# EAGLE schematic Alimentation (EAGLE 9.5.2)
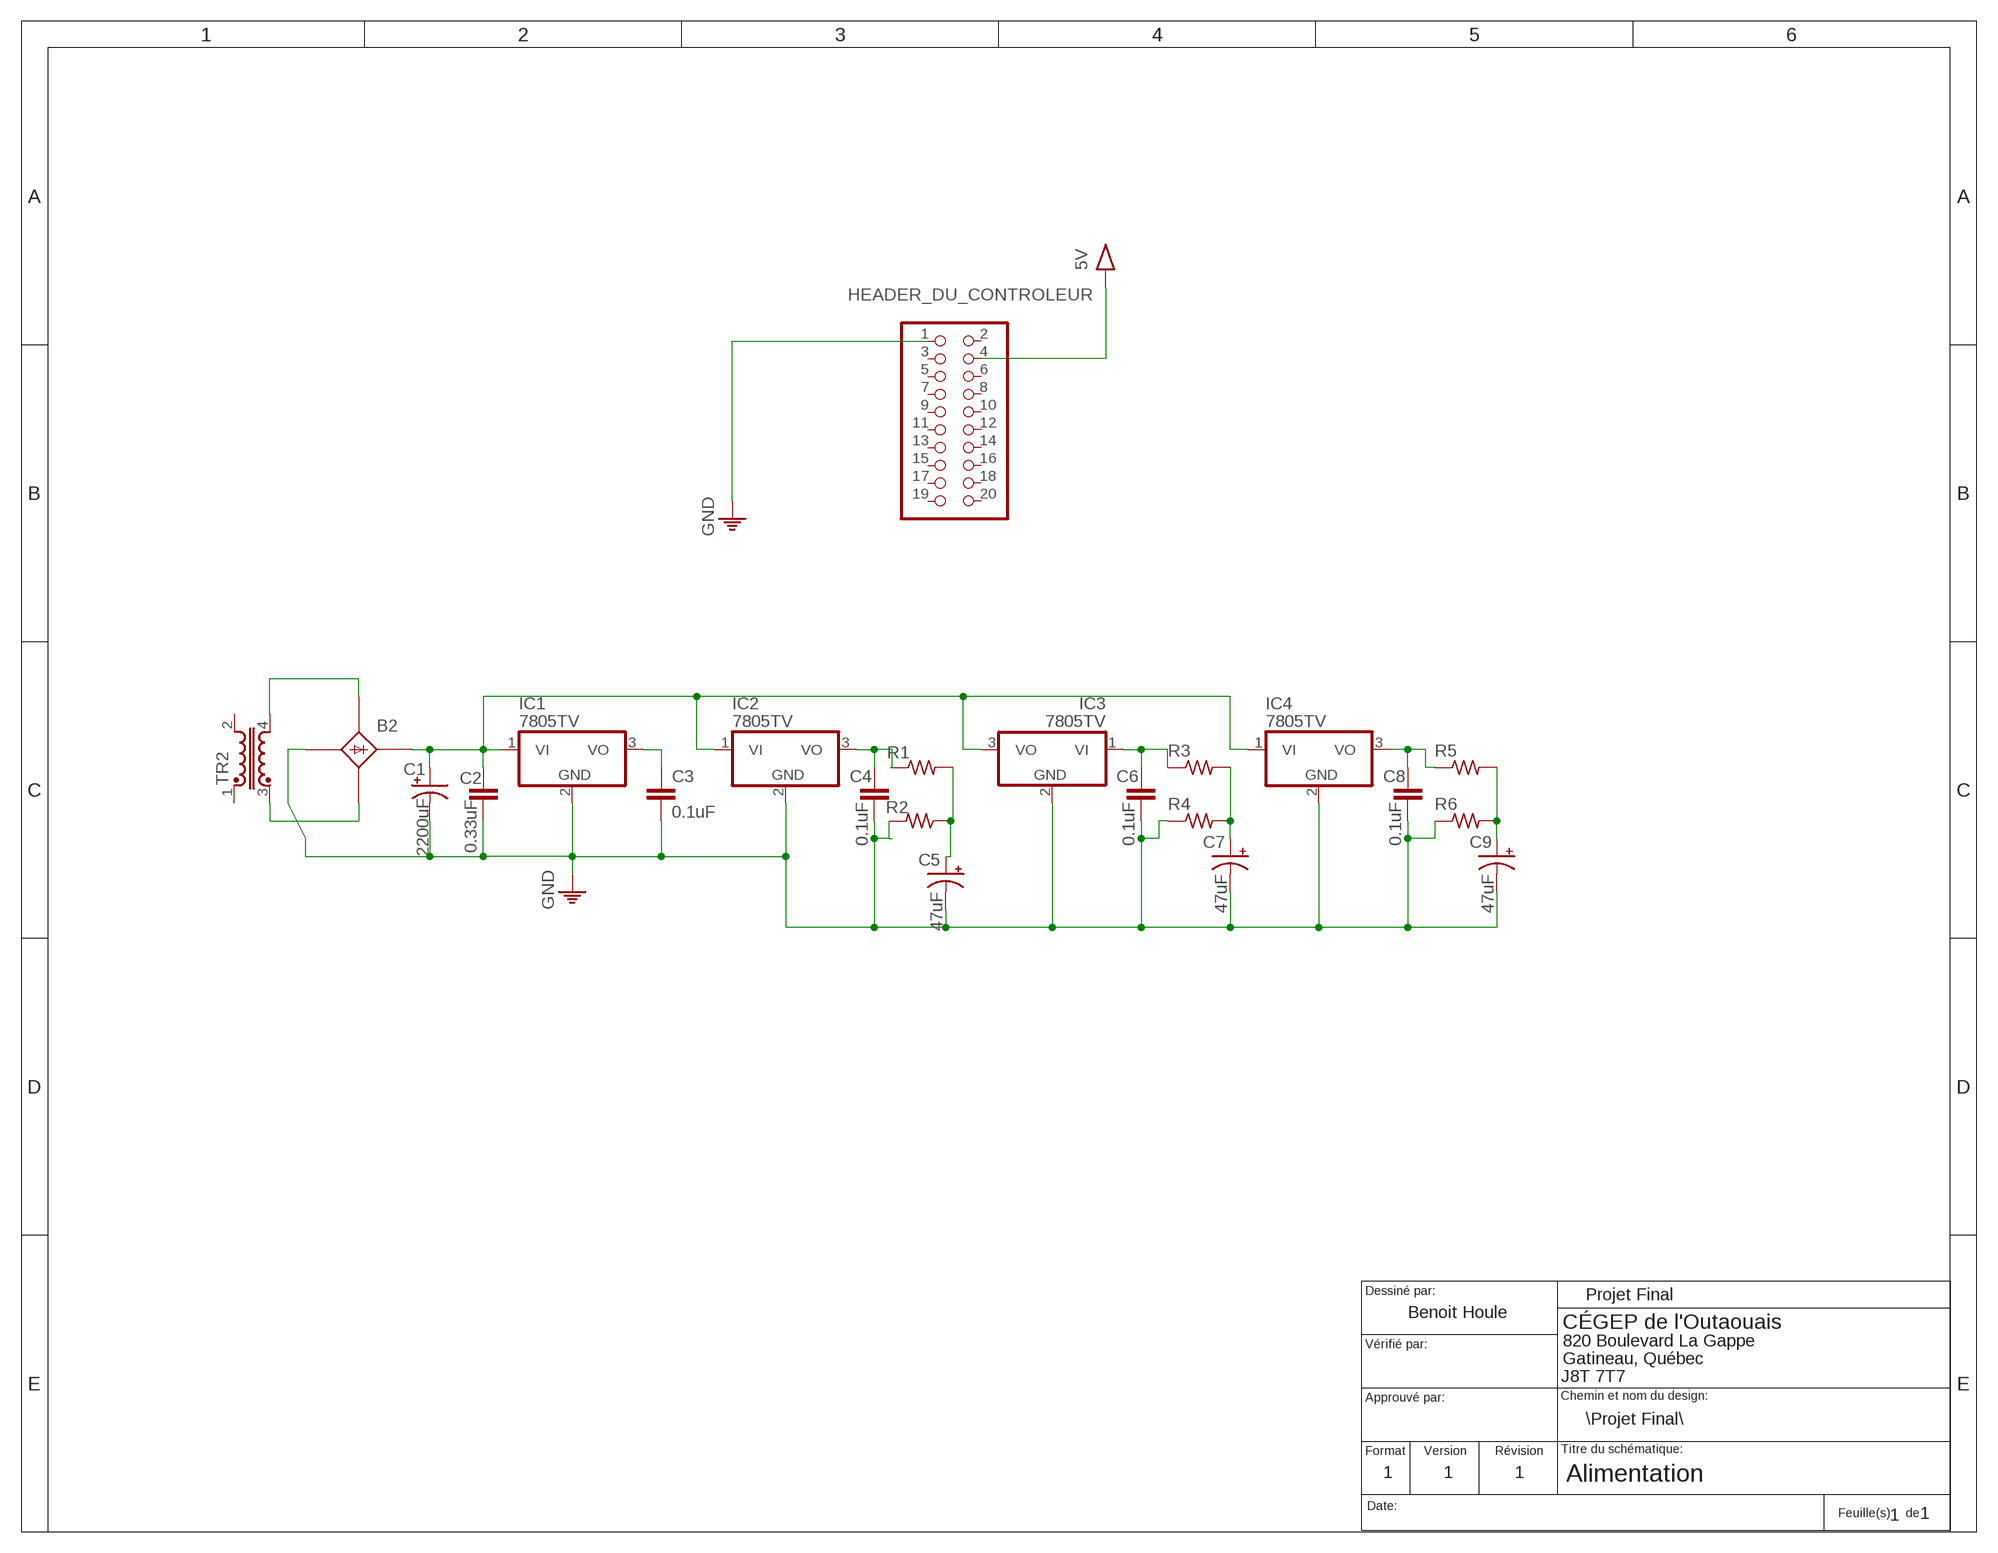
[diagram p0: schematic, sheet 1]

## Parts
B2  B25A-  [B25A-]
C1  2200uF  CPOL-USSANYO_B'  [SANYO-OSCON_B']
C2  0.33uF  C-EU075-032X103  [C075-032X103]
C3  0.1uF  C-EU075-032X103  [C075-032X103]
C4  0.1uF  C-EU075-032X103  [C075-032X103]
C5  47uF  CPOL-USSANYO_B'  [SANYO-OSCON_B']
C6  0.1uF  C-EU075-032X103  [C075-032X103]
C7  47uF  CPOL-USSANYO_B'  [SANYO-OSCON_B']
C8  0.1uF  C-EU075-032X103  [C075-032X103]
C9  47uF  CPOL-USSANYO_B'  [SANYO-OSCON_B']
FRAME1  CARTOUCHE_TGÉ  [CARTOUCHE]
HEADER_DU_CONTROLEUR  PINHD-2X10  [2X10]
IC1  7805TV  [TO220V]
IC2  7805TV  [TO220V]
IC3  7805TV  [TO220V]
IC4  7805TV  [TO220V]
R1  R-US_0207/15  [0207/15]
R2  R-US_0207/15  [0207/15]
R3  R-US_0207/15  [0207/15]
R4  R-US_0207/15  [0207/15]
R5  R-US_0207/15  [0207/15]
R6  R-US_0207/15  [0207/15]
TR2  U15-TRANSFORMER  [U15]

## Nets
5V: C3.1 IC1.3(VO)
N$1: B2.AC1-(AC1) TR2.4
N$2: B2.AC2-(AC2) TR2.3
N$3: B2.+1(+) C1.+ C2.1 IC1.1(VI) IC2.1(VI) IC3.3(VO) IC4.1(VI)
N$4: C4.1 IC2.3(VO) R1.1
N$5: C6.1 IC3.1(VI) R3.1
N$6: C5.+ R1.2 R2.1
N$7: C7.+ R3.2 R4.2
N$9: C8.1 IC4.3(VO) R5.1
N$10: C9.+ R5.2 R6.2
PE: B2.-1(-) C1.- C2.2 C3.2 C4.2 C5.- C6.2 C7.- C8.2 C9.- HEADER_DU_CONTROLEUR.1 IC1.2(GND) IC2.2(GND) IC3.2(GND) IC4.2(GND) R2.2 R4.1 R6.1 ; supply symbol labelled GND
VCC: HEADER_DU_CONTROLEUR.4 ; supply symbol labelled 5V
Unconnected: B2.+ B2.- B2.AC1 B2.AC2 HEADER_DU_CONTROLEUR.2 HEADER_DU_CONTROLEUR.3 HEADER_DU_CONTROLEUR.5 HEADER_DU_CONTROLEUR.6 HEADER_DU_CONTROLEUR.7 HEADER_DU_CONTROLEUR.8 HEADER_DU_CONTROLEUR.9 HEADER_DU_CONTROLEUR.10 HEADER_DU_CONTROLEUR.11 HEADER_DU_CONTROLEUR.12 HEADER_DU_CONTROLEUR.13 HEADER_DU_CONTROLEUR.14 HEADER_DU_CONTROLEUR.15 HEADER_DU_CONTROLEUR.16 HEADER_DU_CONTROLEUR.17 HEADER_DU_CONTROLEUR.18 HEADER_DU_CONTROLEUR.19 HEADER_DU_CONTROLEUR.20 TR2.1 TR2.2

## Notes on the sheet
- Projet Final
- Benoit Houle
- \\Projet Final\\
- 1 | 1 | 1
- 1 | 1

## Library data of the parts
B2 = rectifier:B25A-: RECTIFIER 25-A bridge
C1 C5 C7 C9 = rcl:CPOL-US: POLARIZED CAPACITOR, American symbol; SPICEPREFIX: C
C2-C4 C6 C8 = rcl:C-EU: CAPACITOR, European symbol; SPICEPREFIX: C
FRAME1 = 1_TGE-sur G:CARTOUCHE_TGÉ: Cartouche de TGÉ: Grandeur A, dimention 8 1/2 x 11 pouces, orientation portrait. Les élèves doivent utiliser la commande TEXT pour placer les valeurs aux champs appropriés. Couche 100 Cartouche, ne pas oublier de créer cette couche! Size par défaut: 0,07 ou ajusté en conséquence si pas asez d'espace. Ratio: 8% Font: Vector. Voir la commande TEXT pour plus d'information.
HEADER_DU_CONTROLEUR = 1mylib:PINHD-2X10: PIN HEADER
IC1-IC4 = linear:78*: Positive VOLTAGE REGULATOR Source: http://cache.national.com/ds/LM/LM78L05.pdf http://www.fairchildsemi.com/ds/LM/LM7805.pdf
R1-R6 = 1mylib:R-US_: RESISTOR, American symbol
TR2 = inductor-neosid:U15: TRANSFORMER U15; OC_FARNELL: unknown; OC_NEWARK: unknown